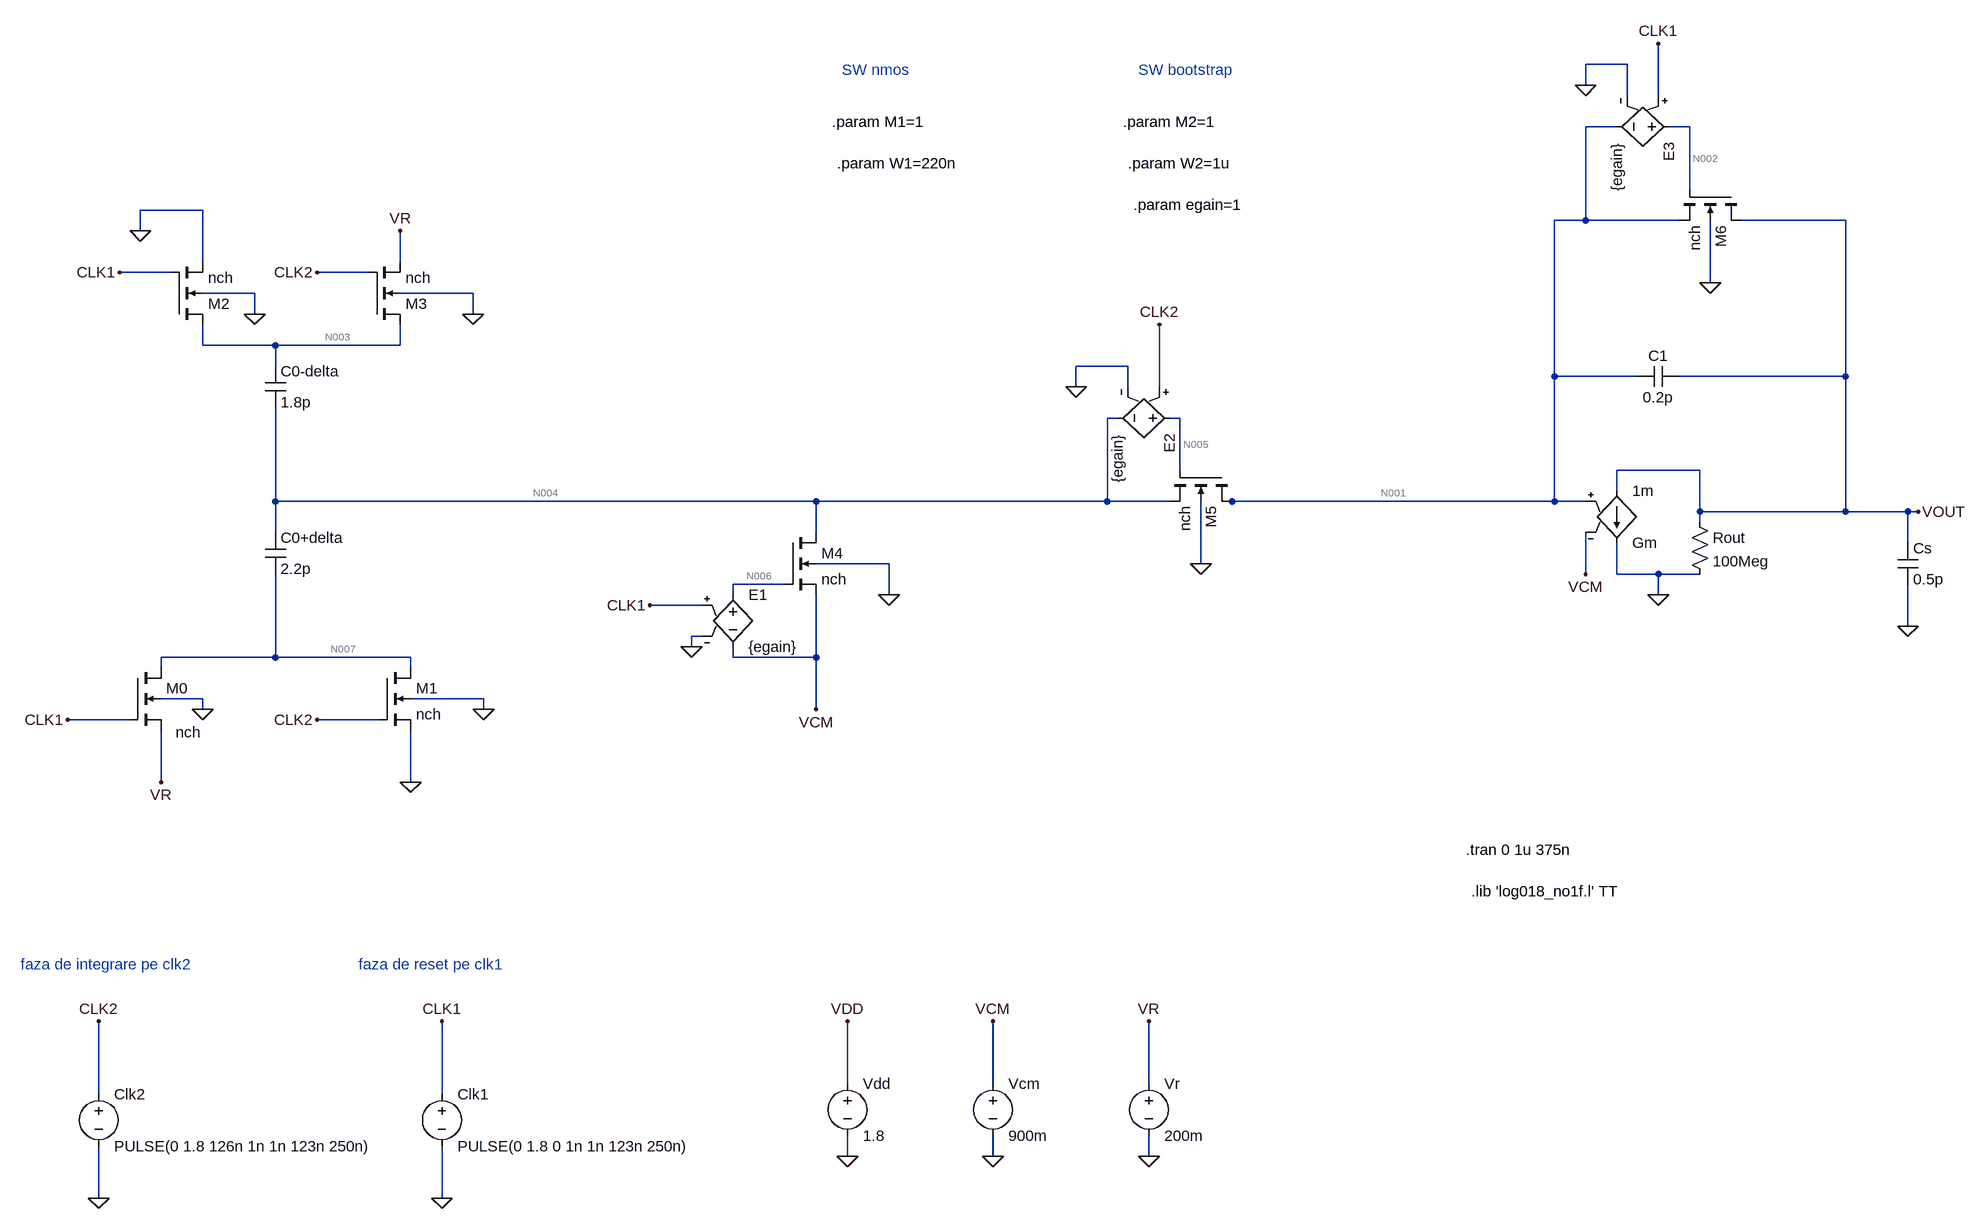
[diagram p0: schematic SCreal_sw.asc]
SCreal_sw.asc, the LTspice schematic file:
Version 4
SHEET 1 2084 1284
WIRE 1520 -480 1456 -480
WIRE 1456 -448 1456 -480
WIRE 1520 -432 1520 -480
WIRE 1568 -432 1568 -512
WIRE 1504 -384 1456 -384
WIRE 1616 -384 1584 -384
WIRE 1616 -288 1616 -384
WIRE -672 -256 -768 -256
WIRE 1456 -240 1456 -384
WIRE 1456 -240 1408 -240
WIRE 1600 -240 1456 -240
WIRE 1856 -240 1696 -240
WIRE -768 -224 -768 -256
WIRE -672 -176 -672 -256
WIRE -368 -176 -368 -224
WIRE -720 -160 -800 -160
WIRE -416 -160 -496 -160
WIRE 1648 -144 1648 -240
WIRE -592 -128 -672 -128
WIRE -256 -128 -368 -128
WIRE -592 -96 -592 -128
WIRE -256 -96 -256 -128
WIRE -672 -48 -672 -80
WIRE -560 -48 -672 -48
WIRE -368 -48 -368 -80
WIRE -368 -48 -560 -48
WIRE -560 -16 -560 -48
WIRE 752 -16 672 -16
WIRE 1408 0 1408 -240
WIRE 1536 0 1408 0
WIRE 1856 0 1856 -240
WIRE 1856 0 1600 0
WIRE 672 16 672 -16
WIRE 752 16 752 -16
WIRE 800 16 800 -80
WIRE 736 64 720 64
WIRE 832 64 816 64
WIRE 832 144 832 64
WIRE 1632 144 1504 144
WIRE 1504 176 1504 144
WIRE -560 192 -560 48
WIRE 272 192 -560 192
WIRE 720 192 720 64
WIRE 720 192 272 192
WIRE 816 192 720 192
WIRE 912 192 896 192
WIRE 1408 192 1408 0
WIRE 1408 192 912 192
WIRE 1456 192 1408 192
WIRE 1632 208 1632 144
WIRE 1856 208 1856 0
WIRE 1856 208 1632 208
WIRE 1952 208 1856 208
WIRE 1968 208 1952 208
WIRE 1632 224 1632 208
WIRE -560 240 -560 192
WIRE 272 240 272 192
WIRE 1952 256 1952 208
WIRE 384 288 272 288
WIRE 864 288 864 192
WIRE 1456 304 1456 240
WIRE 1504 304 1504 256
WIRE 1568 304 1504 304
WIRE 1632 304 1568 304
WIRE 224 320 144 320
WIRE 144 336 144 320
WIRE 384 336 384 288
WIRE 1568 336 1568 304
WIRE 96 352 16 352
WIRE 1952 384 1952 320
WIRE 96 400 80 400
WIRE 80 416 80 400
WIRE -560 432 -560 304
WIRE -560 432 -736 432
WIRE -352 432 -560 432
WIRE 144 432 144 416
WIRE 272 432 272 336
WIRE 272 432 144 432
WIRE -736 448 -736 432
WIRE -352 448 -352 432
WIRE -672 496 -736 496
WIRE -240 496 -352 496
WIRE -672 512 -672 496
WIRE -240 512 -240 496
WIRE 272 512 272 432
WIRE -784 528 -880 528
WIRE -400 528 -496 528
WIRE -736 624 -736 544
WIRE -352 624 -352 544
WIRE 320 1088 320 992
WIRE 544 1088 544 992
WIRE 784 1088 784 992
WIRE -832 1104 -832 992
WIRE -304 1104 -304 992
WIRE 320 1200 320 1168
WIRE 544 1200 544 1168
WIRE 784 1200 784 1168
WIRE -832 1264 -832 1184
WIRE -304 1264 -304 1184
FLAG -496 528 CLK2
FLAG -496 -160 CLK2
FLAG -800 -160 CLK1
FLAG -880 528 CLK1
FLAG -768 -224 0
FLAG -352 624 0
FLAG -736 624 VR
FLAG -368 -224 VR
FLAG -304 992 CLK1
FLAG -832 992 CLK2
FLAG -304 1264 0
FLAG -832 1264 0
FLAG 320 1200 0
FLAG 544 1200 0
FLAG 784 1200 0
FLAG 784 992 VR
FLAG 544 992 VCM
FLAG 320 992 VDD
FLAG 1968 208 VOUT
FLAG 1568 -512 CLK1
FLAG 800 -80 CLK2
FLAG 16 352 CLK1
FLAG 272 512 VCM
FLAG 1568 336 0
FLAG 1456 304 VCM
FLAG -240 512 0
FLAG -672 512 0
FLAG -592 -96 0
FLAG -256 -96 0
FLAG 1952 384 0
FLAG 384 336 0
FLAG 80 416 0
FLAG 864 288 0
FLAG 672 16 0
FLAG 1456 -448 0
FLAG 1648 -144 0
SYMBOL cap -576 -16 R0
SYMATTR InstName C0-delta
SYMATTR Value 1.8p
SYMBOL cap -576 240 R0
SYMATTR InstName C0+delta
SYMATTR Value 2.2p
SYMBOL voltage -304 1088 R0
WINDOW 123 0 0 Left 0
WINDOW 39 0 0 Left 0
SYMATTR InstName Clk1
SYMATTR Value PULSE(0 1.8 0 1n 1n 123n 250n)
SYMBOL voltage -832 1088 R0
WINDOW 123 0 0 Left 0
WINDOW 39 0 0 Left 0
SYMATTR InstName Clk2
SYMATTR Value PULSE(0 1.8 126n 1n 1n 123n 250n)
SYMBOL voltage 544 1072 R0
SYMATTR InstName Vcm
SYMATTR Value 900m
SYMBOL voltage 784 1072 R0
SYMATTR InstName Vr
SYMATTR Value 200m
SYMBOL voltage 320 1072 R0
SYMATTR InstName Vdd
SYMATTR Value 1.8
SYMBOL cap 1600 -16 R90
WINDOW 0 0 32 VBottom 2
WINDOW 3 32 32 VTop 2
SYMATTR InstName C1
SYMATTR Value 0.2p
SYMBOL g2 1504 272 M180
SYMATTR InstName Gm
SYMATTR Value 1m
SYMBOL res 1616 208 R0
SYMATTR InstName Rout
SYMATTR Value 100Meg
SYMBOL nmos4 -400 448 R0
SYMATTR InstName M1
SYMATTR Value2 l=180n w=W1 m=M1
SYMATTR Value nch
SYMBOL nmos4 -784 448 R0
WINDOW 3 70 99 Left 2
SYMATTR Value nch
SYMATTR InstName M0
SYMATTR Value2 l=180n w=W1 m=M1
SYMBOL cap 1936 256 R0
SYMATTR InstName Cs
SYMATTR Value 0.5p
SYMBOL nmos4 -720 -80 M180
SYMATTR InstName M2
SYMATTR Value nch
SYMATTR Value2 l=180n w=W1 m=M1
SYMBOL nmos4 -416 -80 M180
SYMATTR InstName M3
SYMATTR Value nch
SYMATTR Value2 l=180n w=W1 m=M1
SYMBOL nmos4 224 240 R0
SYMATTR InstName M4
SYMATTR Value2 l=180n w=W2 m=M2
SYMATTR Value nch
SYMBOL e 144 320 R0
SYMATTR InstName E1
SYMATTR Value {egain}
SYMBOL e 832 64 R90
SYMATTR InstName E2
SYMATTR Value {egain}
SYMBOL e 1600 -384 R90
SYMATTR InstName E3
SYMATTR Value {egain}
SYMBOL nmos4 912 144 R90
SYMATTR InstName M5
SYMATTR Value2 l=180n w=W2 m=M2
SYMATTR Value nch
SYMBOL nmos4 1696 -288 R90
SYMATTR InstName M6
SYMATTR Value2 l=180n w=W2 m=M2
SYMATTR Value nch
TEXT 1272 728 Left 2 !.tran 0 1u 375n
TEXT -952 904 Left 2 ;faza de integrare pe clk2
TEXT -432 904 Left 2 ;faza de reset pe clk1
TEXT 1280 792 Left 2 !.lib 'log018_no1f.l' TT
TEXT 296 -392 Left 2 !.param M1=1
TEXT 304 -328 Left 2 !.param W1=220n
TEXT 744 -392 Left 2 !.param M2=1
TEXT 752 -328 Left 2 !.param W2=1u
TEXT 768 -472 Left 2 ;SW bootstrap
TEXT 312 -472 Left 2 ;SW nmos
TEXT 760 -264 Left 2 !.param egain=1

The netlist it stands for:
* SCreal_sw.asc
C0-delta N003 N004 1.8p
C0+delta N004 N007 2.2p
V§Clk1 CLK1 0 PULSE(0 1.8 0 1n 1n 123n 250n)
V§Clk2 CLK2 0 PULSE(0 1.8 126n 1n 1n 123n 250n)
Vcm VCM 0 900m
Vr VR 0 200m
Vdd VDD 0 1.8
C1 VOUT N001 0.2p
Gm VOUT 0 N001 VCM 1m
Rout VOUT 0 100Meg
M1 N007 CLK2 0 0 nch l=180n w=W1 m=M1
M0 N007 CLK1 VR 0 nch l=180n w=W1 m=M1
Cs VOUT 0 0.5p
M2 N003 CLK1 0 0 nch l=180n w=W1 m=M1
M3 N003 CLK2 VR 0 nch l=180n w=W1 m=M1
M4 N004 N006 VCM 0 nch l=180n w=W2 m=M2
E1 N006 VCM CLK1 0 {egain}
E2 N005 N004 CLK2 0 {egain}
E3 N002 N001 CLK1 0 {egain}
M5 N001 N005 N004 0 nch l=180n w=W2 m=M2
M6 VOUT N002 N001 0 nch l=180n w=W2 m=M2
.model NMOS NMOS
.model PMOS PMOS
.lib standard.mos
.tran 0 1u 375n
* faza de integrare pe clk2
* faza de reset pe clk1
.lib 'log018_no1f.l' TT
.param M1=1
.param W1=220n
.param M2=1
.param W2=1u
* SW bootstrap
* SW nmos
.param egain=1
.backanno
.end

* Results of the author's LTspice run, read from the files saved beside the schematic
* Operating Point, zero values left out:
*   V(n003) = 20.56 mV
*   V(n004) = 743.9 mV
*   V(n007) = 20.56 mV
*   V(vcm) = 900 mV
*   V(vr) = 200 mV
*   V(vdd) = 1.8 V
*   V(vout) = 8.785 V
*   V(n001) = 899.9 mV
*   V(n006) = 900 mV
*   V(n005) = 743.9 mV
*   V(n002) = 899.9 mV
*   Id(M6) = 10.87 pA
*   Ib(M6) = -9.945 pA
*   Ib(M5) = -1.664 pA
*   Ib(M4) = -1.664 pA
*   Is(M4) = 2.404 pA
*   Id(M3) = -1.583 pA
*   Is(M3) = 1.819 pA
*   Id(M2) = 1.583 pA
*   Is(M2) = -1.557 pA
*   Id(M0) = -1.583 pA
*   Is(M0) = 1.819 pA
*   Id(M1) = 1.583 pA
*   Is(M1) = -1.557 pA
*   I(Rout) = 87.85 nA
*   I(Gm) = -87.86 nA
*   I(Vr) = -3.638 pA
*   I(Vcm) = -2.404 pA
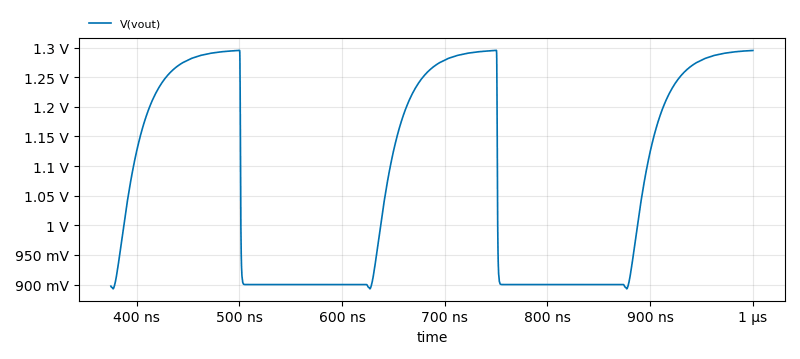
[diagram p1: Transient Analysis of SCreal_sw.asc, plotted from the saved traces]
* Transient Analysis, 1 run:
*   V(vout): min 892.8 mV, max 1.295 V, average 1.086 V, rms 1.1 V, last 1.295 V